# Altium schematic sheet 01_MCU.SchDoc
size A4; Date: 25/04/2023; CheckedBy: Yen Doo; Author: Hnit; DrawnBy: Hnit; DocumentNumber: 01; Revision: 01; SheetNumber: 1; SheetTotal: 1; Time: 00:00:00
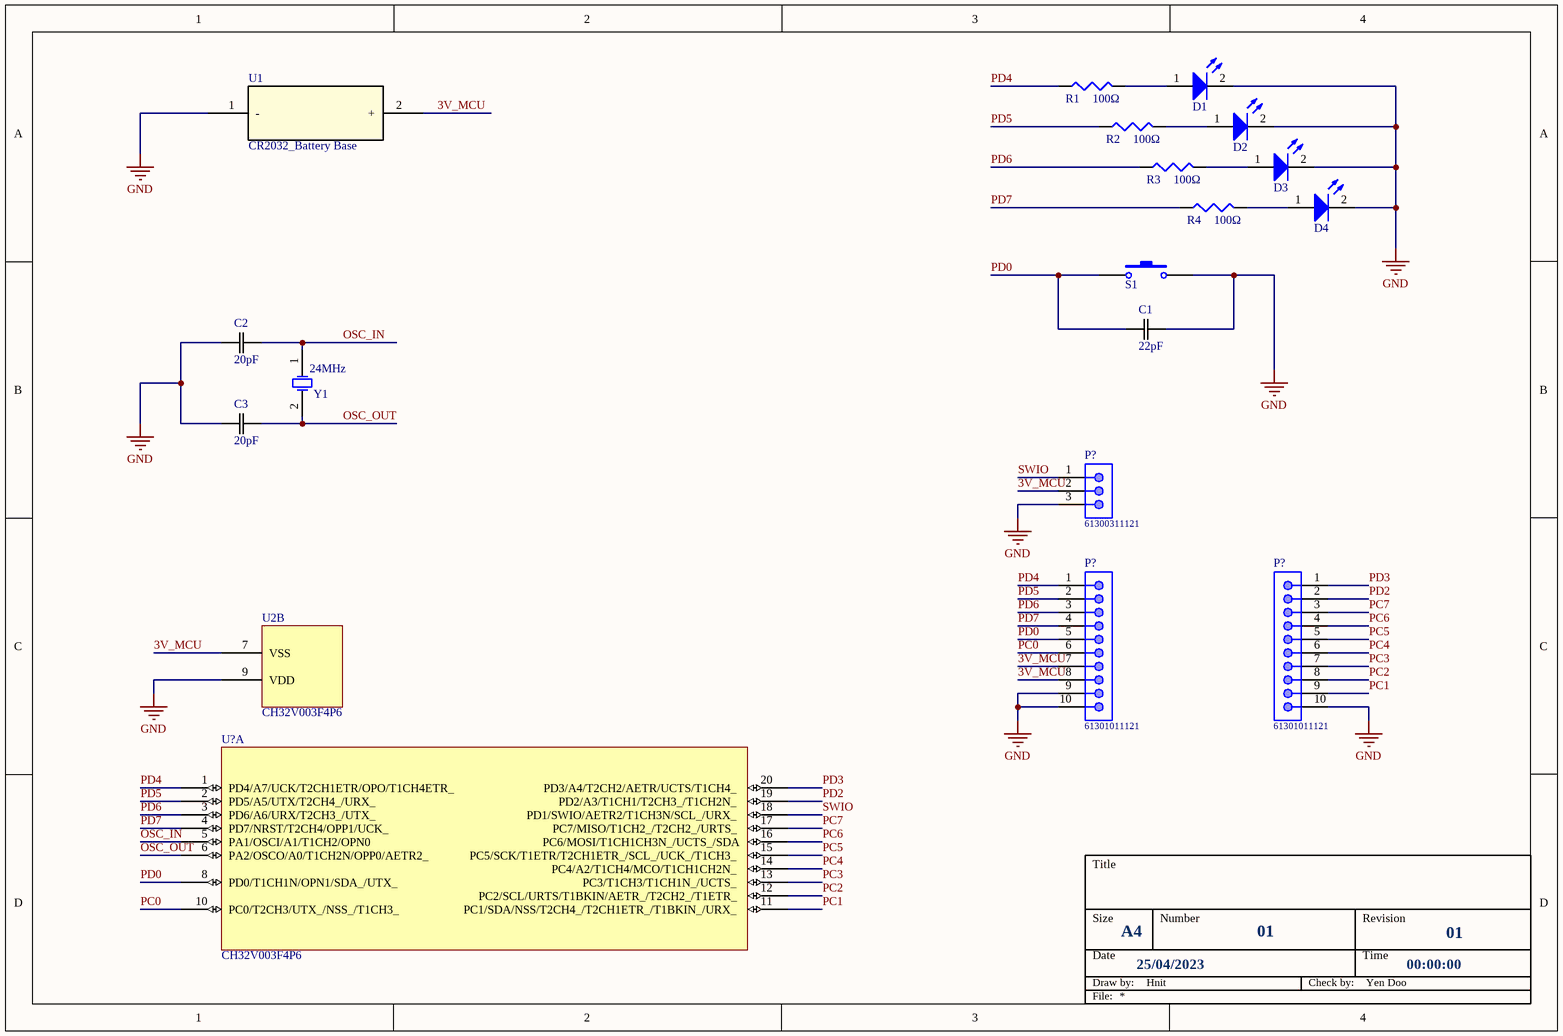
[diagram p0: 01_MCU.SchDoc]

## Parts
(Parts that share a designator on the sheet are numbered #1, #2 ... from top to bottom, then left to right.)
C1  22pF  [CAPC17595_87N_KEM_0603]
C2  20pF  [CAPC17595_87N_KEM_0603]
C3  20pF  [CAPC17595_87N_KEM_0603]
D1  Color ? , 3.2V, 140°  [WL-SMCW_0603_150060xx75003]  (value not drawn)
D2  Color ? , 3.2V, 140°  [WL-SMCW_0603_150060xx75003]  (value not drawn)
D3  Color ? , 3.2V, 140°  [WL-SMCW_0603_150060xx75003]  (value not drawn)
D4  Color ? , 3.2V, 140°  [WL-SMCW_0603_150060xx75003]  (value not drawn)
P?#1  61300311121  [61300311121]
P?#2  61301011121  [61301011121]
P?#3  61301011121  [61301011121]
R1  100Ω  [WRIS-PSMB_0603_L1.6W0.8H0.3 - duplicate]
R2  100Ω  [WRIS-PSMB_0603_L1.6W0.8H0.3 - duplicate]
R3  100Ω  [WRIS-PSMB_0603_L1.6W0.8H0.3 - duplicate]
R4  100Ω  [WRIS-PSMB_0603_L1.6W0.8H0.3 - duplicate]
S1  Tact SW - 2Pin  [SW-SMD]  (value not drawn)
U1  CR2032_Battery Base  [TO_106_KEY]
U2  CH32V003F4P6  [TSSOP20]  (part B of 2)
U?  CH32V003F4P6  [TSOP20_CH32V003]  (part A of 2)
Y1  24MHz  [XT2]

## Nets
GND: C1.2 C2.1 C3.1 D1.2(K) D2.2(K) D3.2(K) D4.2(K) P?#1.3 P?#2.9 P?#2.10 P?#3.10 S1.2 U1.1(-) U2.9(VDD)
3V_MCU: P?#1.2 P?#2.7 P?#2.8 U1.2(+) U2.7(VSS)
OSC_IN: C2.2 U?.5(PA1/OSCI/A1/T1CH2/OPN0) Y1.1(OSC1)
OSC_OUT: C3.2 U?.6(PA2/OSCO/A0/T1CH2N/OPP0/AETR2_) Y1.2(OSC2)
PC0: P?#2.6 U?.10(PC0/T2CH3/UTX_/NSS_/T1CH3_)
PC1: P?#3.9 U?.11(PC1/SDA/NSS/T2CH4_/T2CH1ETR_/T1BKIN_/URX_)
PC2: P?#3.8 U?.12(PC2/SCL/URTS/T1BKIN/AETR_/T2CH2_/T1ETR_)
PC3: P?#3.7 U?.13(PC3/T1CH3/T1CH1N_/UCTS_)
PC4: P?#3.6 U?.14(PC4/A2/T1CH4/MCO/T1CH1CH2N_)
PC5: P?#3.5 U?.15(PC5/SCK/T1ETR/T2CH1ETR_/SCL_/UCK_/T1CH3_)
PC6: P?#3.4 U?.16(PC6/MOSI/T1CH1CH3N_/UCTS_/SDA)
PC7: P?#3.3 U?.17(PC7/MISO/T1CH2_/T2CH2_/URTS_)
PD0: C1.1 P?#2.5 S1.1 U?.8(PD0/T1CH1N/OPN1/SDA_/UTX_)
PD2: P?#3.2 U?.19(PD2/A3/T1CH1/T2CH3_/T1CH2N_)
PD3: P?#3.1 U?.20(PD3/A4/T2CH2/AETR/UCTS/T1CH4_)
PD4: P?#2.1 R1.1 U?.1(PD4/A7/UCK/T2CH1ETR/OPO/T1CH4ETR_)
PD5: P?#2.2 R2.1 U?.2(PD5/A5/UTX/T2CH4_/URX_)
PD6: P?#2.3 R3.1 U?.3(PD6/A6/URX/T2CH3_/UTX_)
PD7: P?#2.4 R4.1 U?.4(PD7/NRST/T2CH4/OPP1/UCK_)
SWIO: P?#1.1 U?.18(PD1/SWIO/AETR2/T1CH3N/SCL_/URX_)
NetD1_1: D1.1(A) R1.2
NetD2_1: D2.1(A) R2.2
NetD3_1: D3.1(A) R3.2
NetD4_1: D4.1(A) R4.2

## Notes on the sheet
- Title
- Size
- Number
- Revision
- Date
- Draw by:
- A4
- Check by:
- Time
- File:

## Library data of the parts
C1-C3 = Capacitor_SMD: No Description Available; Mfr_Name: Kemet; Manufacturer_Part_Number: C1206C104K5RACTU; Type: DEV; Copyright: Copyright (C) 2023 Ultra Librarian. All rights reserved.; RefDes: RefDes
D1-D4 = LED_smd: WL-SMCW Mono-color Chip LED Waterclear, size ?, color ?, 3.2V, 140°; Manufacturer Part Number: 150060BS75003; Manufacturer: Wurth Elektronik; Case/Size Code: 0603; Chip Technology: InGaN; Dominant Wavelength: 470nm; Emitting Color: Blue; Luminous Intensity: 350mcd; Peak Wavelength: 465nm; Category: Signal LEDs; Match Code: WL-SMCW; ComponentLink1Description: Website Link; ComponentLink1URL: https://www.we-online.com/redexpert/article/150060BS75003?ad; ComponentLink2Description: Datasheet Link; ComponentLink2URL: https://www.we-online.com/redexpert/spec/150060BS75003?ad; Mount: Surface Mount; Operating Temperature Max: 100°C; Operating Temperature Min: -40°C; Packaging: Tape and Reel; Length: 1.6mm; Width: 0.8mm; Height: 0.7mm; Forward Voltage: 3.2V; Viewing Angle: 140°
P?#1 = 61300311121: WR-PHD Pin Header, THT, pitch 2.54mm, Single Row, Vertical, 3p; Manufacturer: Wurth Elektronik; Pin Number: 3; Rated Current: 3A; Working Voltage: 250VAC; Withstanding Voltage: 500VAC; Contact Resistance: 20mOhm; ComponentLink1Description: Manufacturer; ComponentLink1URL: http://www.we-online.de; ComponentLink2Description: Datasheet; ComponentLink2URL: https://www.we-online.com/catalog/datasheet/61300311121.pdf; Manufacturer Part Number: 61300311121; Published Date: May 2020; Pitch: 2.54mm; Operating Temperature: -40 to +105degC; Mounting Technology: THT; Packaging: Bag; Gender: Pin Header; Row Number: Single; Orientation: Vertical
P?#2 P?#3 = 61301011121: WR-PHD Pin Header, THT, pitch 2.54mm, Single Row, Vertical, 10p; Manufacturer: Wurth Elektronik; Pin Number: 10; Rated Current: 3A; Working Voltage: 250VAC; Withstanding Voltage: 500VAC; Contact Resistance: 20mOhm; ComponentLink1Description: Manufacturer; ComponentLink1URL: http://www.we-online.de; ComponentLink2Description: Datasheet; ComponentLink2URL: https://www.we-online.com/catalog/datasheet/61301011121.pdf; Manufacturer Part Number: 61301011121; Published Date: May 2020; Pitch: 2.54mm; Operating Temperature: -40 to +105degC; Mounting Technology: THT; Packaging: Bag; Gender: Pin Header; Row Number: Single; Orientation: Vertical
R1-R4 = Resistor_SMD: WRIS-PSMC Metal Plate Resistor, SMT, size 2512, 2W, 5mΩ, +/-1%; Manufacturer Part Number: 580070763005; Manufacturer: Wurth Elektronik; Case/Size Code: 2512; Rated Current: 20A; Technical Reference: MC2512R005F201KAATE0000; Temperature Coefficient of Resistance: +/-100ppm/°C; Category: Metal Plate Resistors; Match Code: WRIS-PSMC; ComponentLink1Description: Website Link; ComponentLink1URL: https://www.we-online.com/redexpert/article/580070763005?ad; ComponentLink2Description: Datasheet Link; ComponentLink2URL: https://www.we-online.com/redexpert/spec/580070763005?ad; Mount: Surface Mount; Operating Temperature Max: 155°C; Operating Temperature Min: -55°C; Packaging: Tape and Reel; Length: 6.3mm; Width: 3.1mm; Height: 0.51mm; Rated Power: 2W; Resistance: 5mΩ; Resistance Tolerance: +/-1%
S1 = Tact SW - 2Pin: Switch button 2 pin
U1 = CR2032_Battery Base: No Description Available; Mfr_Name: Keystone Electronics; RefDes: RefDes; Type: Type
U2 U? = CH32V003F4P6: CH32V003 series is based on QingKe RISC-V2A core design of industrial-grade general-purpose microcontroller, support 48MHz system main frequency, with wide voltage, 1-wire serial debug interface, low-power consumption, ultra-small package, etc. CH32V003 series built-in a group of DMA controller, a group of 10-bit ADC, a group of op-amp comparators, multiple timers and standard communication interfaces USART, I2C, SPI, etc.; Manufaccture: WCH; SRAM: 2KB, starting address 0x20000000, supports byte, half-word,(2 bytes), and full-word (4bytes) access; FLASH: 16KB program Flash memory (CodeFlash) for storing user applications; System memory: 1920B (bootloader) for storing the system bootloader (factory-cured bootloader); Vendor configuration word storage, factory-cured and unmodifiable by users: 64B; Operating voltage: 2.7V to 5.5V; Built-in voltage regulator: 1.5V power supply required by the core; LSI: 128kHz; HSI: 8MHz, 16MHz, 24MHz, 48MHz; HSE: 4~25MHz; User-selected word storage: 64B; ComponentLink1Description: Datasheet; ComponentLink1URL: http://www.wch-ic.com/downloads/CH32V003DS0_PDF.html; ComponentLink2Description: Reference Manual; ComponentLink2URL: http://www.wch-ic.com/downloads/CH32V003RM_PDF.html; ComponentLink3Description: Evaluation board manual and reference routines; ComponentLink3URL: http://www.wch.cn/downloads/CH32V003EVT_ZIP.html; ComponentLink4Description: IDE; ComponentLink4URL: http://www.wch-ic.com/products/www.mounriver.com/
Y1 = XTAL: Crystal Oscillator; Published: 8-Jun-2000; LatestRevisionDate: 17-Jul-2002; LatestRevisionNote: Re-released for DXP Platform.; PackageReference: R38; Publisher: Altium Limited; PackageDescription: Crystal, Thru-Hole; 2 Leads; Body 3.1 x 8.2 mm (Dia.xH)